# Altium schematic sheet Sheet1.SchDoc
size A; SheetNumber: 1; SheetTotal: 1
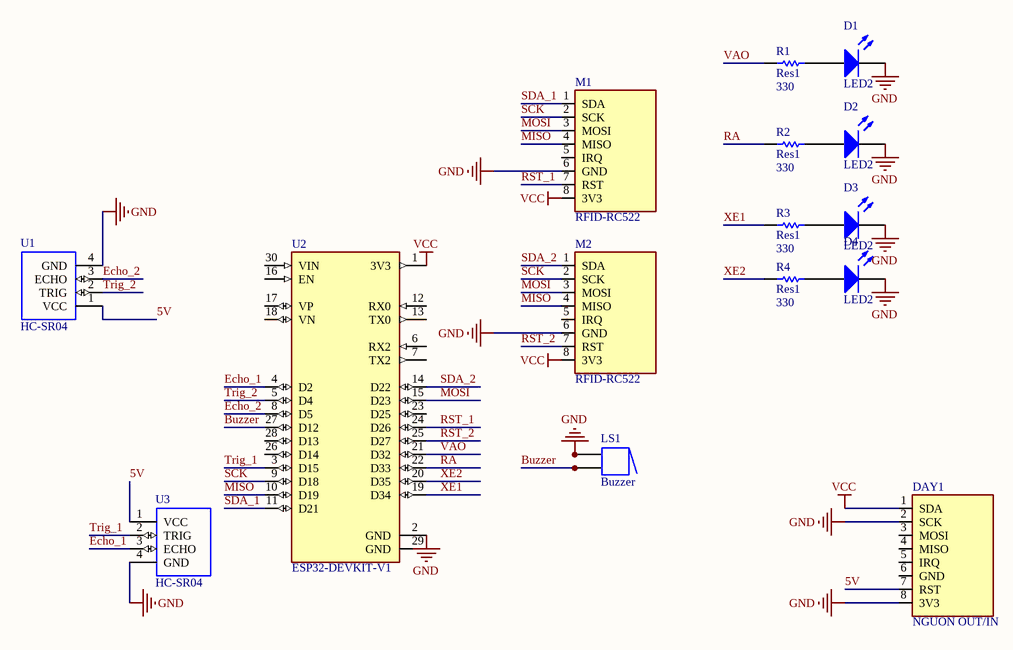
[diagram p0: Sheet1.SchDoc]

## Parts
D1  LED2  [3.2X1.6X1.1]
D2  LED2  [3.2X1.6X1.1]
D3  LED2  [3.2X1.6X1.1]
D4  LED2  [3.2X1.6X1.1]
DAY1  NGUON OUT/IN  [RFID-RC522]
LS1  Buzzer  [ABSM-1574]
M1  RFID-RC522  [RFID-RC522]
M2  RFID-RC522  [RFID-RC522]
R1  Res1  value 330  [AXIAL-0.3]
R2  Res1  value 330  [AXIAL-0.3]
R3  Res1  value 330  [AXIAL-0.3]
R4  Res1  value 330  [AXIAL-0.3]
U1  HC-SR04  [XCVR_HC-SR04]
U2  ESP32-DEVKIT-V1  [MODULE_ESP32_DEVKIT_V1]
U3  HC-SR04  [XCVR_HC-SR04]

## Nets
GND: D1.2(K) D2.2(K) D3.2(K) D4.2(K) DAY1.2(SCK) DAY1.8(3V3) LS1.1 LS1.1A M1.6(GND) M2.6(GND) U1.4(GND) U2.2(GND) U3.4(GND)
VCC: DAY1.1(SDA) M1.8(3V3) M2.8(3V3) U2.1(3V3)
5V: DAY1.7(RST) U1.1(VCC) U3.1(VCC)
Buzzer: LS1.2 LS1.2A U2.27(D12)
Echo_1: U2.4(D2) U3.3(ECHO)
Echo_2: U1.3(ECHO) U2.8(D5)
MISO: M1.4(MISO) M2.4(MISO) U2.10(D19)
MOSI: M1.3(MOSI) M2.3(MOSI) U2.15(D23)
RA: R2.1 U2.22(D33)
RST_1: M1.7(RST) U2.24(D26)
RST_2: M2.7(RST) U2.25(D27)
SCK: M1.2(SCK) M2.2(SCK) U2.9(D18)
SDA_1: M1.1(SDA) U2.11(D21)
SDA_2: M2.1(SDA) U2.14(D22)
Trig_1: U2.3(D15) U3.2(TRIG)
Trig_2: U1.2(TRIG) U2.5(D4)
VAO: R1.1 U2.21(D32)
XE1: R3.1 U2.19(D34)
XE2: R4.1 U2.20(D35)
NetD1_1: D1.1(A) R1.2
NetD2_1: D2.1(A) R2.2
NetD3_1: D3.1(A) R3.2
NetD4_1: D4.1(A) R4.2

Not connected (* = marked no-connect by the designer): DAY1 3(MOSI) 4(MISO) 5(IRQ) 6(GND); M1 5(IRQ); M2 5(IRQ); U2 6(RX2) 7(TX2) 12(RX0) 13(TX0) 16(EN) 17(VP) 18(VN) 23(D25) 26(D14) 28(D13) 29(GND) 30(VIN)

## Library data of the parts
D1-D4 = LED2: Typical RED, GREEN, YELLOW, AMBER GaAs LED; Published: 8-Jun-2000; LatestRevisionDate: 17-Jul-2002; LatestRevisionNote: Re-released for DXP Platform.; PackageVersion: Feb-2002; PackageReference: 3.2X1.6X1.1; Publisher: Altium Limited; PackageDescription: SM LED; 2 Flat Leads
DAY1 M1 M2 = RFID-RC522: Bá»™ cÃ´ng cá»¥ phÃ¡t triá»ƒn trong IC Ä‘áº§u Ä‘á»c/ghi tÃ­ch há»£p MFRC522 Ä‘á»ƒ liÃªn láº¡c khÃ´ng tiáº¿p xÃºc á»Ÿ táº§n sá»‘ 13,56 MHz.; MF: Handson Technology; SnapEDA_Link: https://www.snapeda.com/parts/RFID-RC522/Handson+Technology/view-part/?ref=snap; Package: Package; Value: *; MP: RFID-RC522; Check_prices: https://www.snapeda.com/parts/RFID-RC522/Handson+Technology/view-part/?ref=eda
LS1 = Buzzer: Magnetic Transducer Buzzer; Published: 24-Mar-1999; LatestRevisionDate: 17-Dec-2003; LatestRevisionNote: Schematic revised, PCB Footprint replaced.; DatasheetVersion: 17-Dec-2003; PackageReference: ABSM-1574; Publisher: Altium Limited; PackageDescription: Magnetic Transducer Buzzer; ComponentLink1Description: Manufacturer Link; ComponentLink1URL: http://www.megastar.com/linecard/buzzmode/index.php
R1-R4 = Res1: Resistor; Published: 8-Jun-2000; LatestRevisionDate: 17-Jul-2002; LatestRevisionNote: Re-released for DXP Platform.; PackageReference: AXIAL-0.3; Publisher: Altium Limited; PackageDescription: Axial Device, Thru-Hole; 2 Leads; 0.3 in Pin Spacing
U1 U3 = HC-SR04: Ultrasonic Sensor Module; Availability: Unavailable; MP: HC-SR04; Value: *; Price: None; Package: None
U2 = ESP32-DEVKIT-V1: Dual core, Wi-Fi: 2.4 GHz up to 150 Mbits/s,BLE (Bluetooth Low Energy) and legacy Bluetooth, 32 bits, Up to 240 MHz; MF: Do it; Price: None; Availability: Not in stock; Package: None; MP: ESP32-DEVKIT-V1; Value: *; SnapEDA_Link: https://www.snapeda.com/parts/ESP32-DEVKIT-V1/Do+it/view-part/?ref=snap; Check_prices: https://www.snapeda.com/parts/ESP32-DEVKIT-V1/Do+it/view-part/?ref=eda